# EAGLE design MGB-001-IO-NO-AUDIO (EAGLE 9.6.2)

## Sheet 1 of 2: GPIO
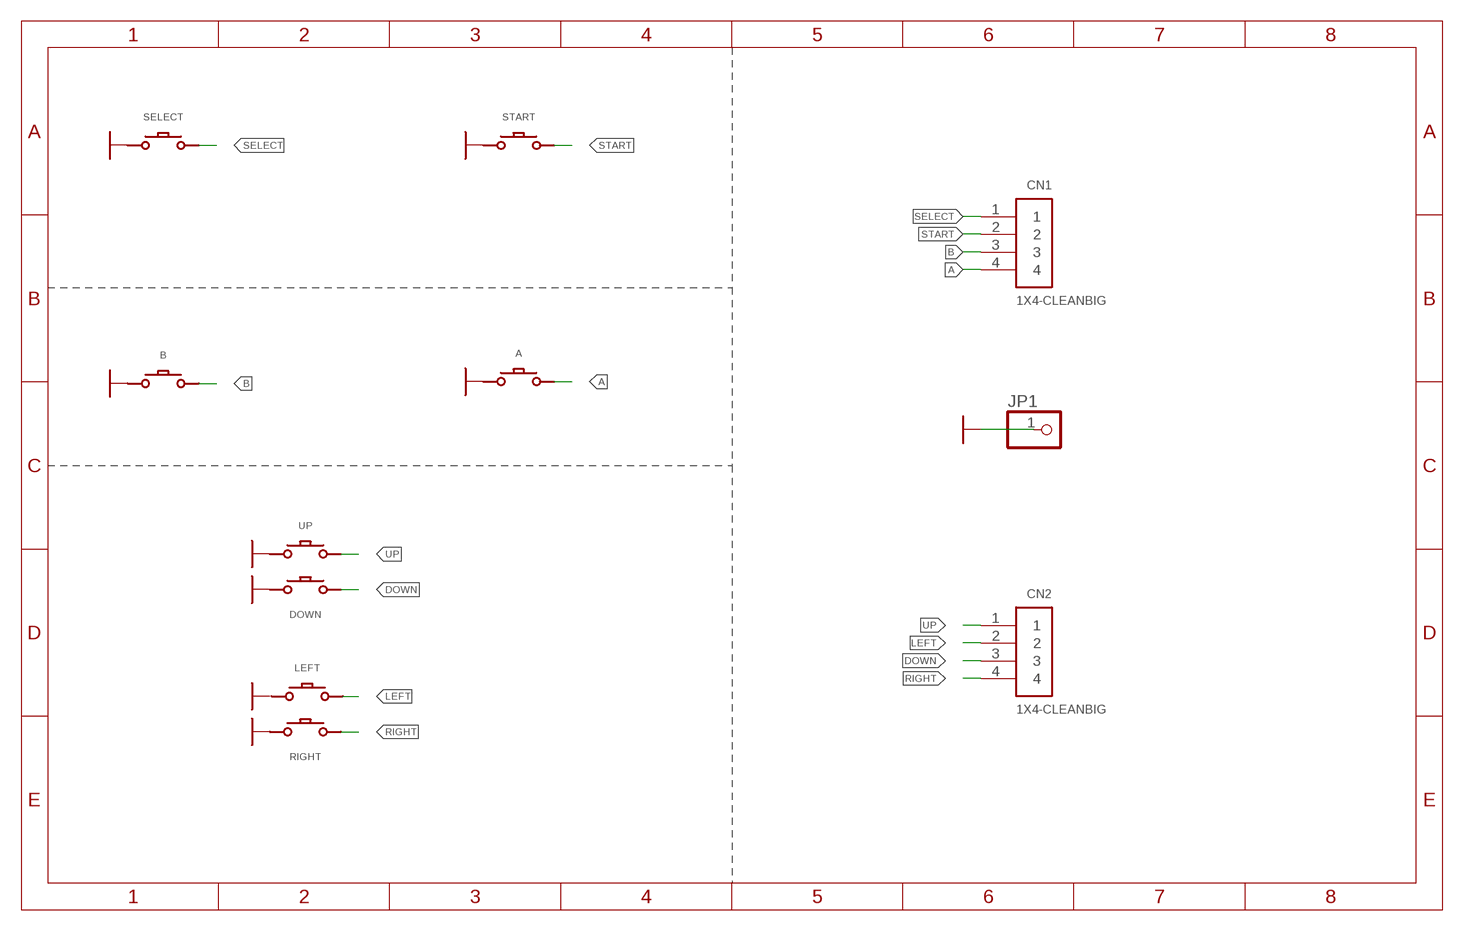
[diagram p0: schematic, sheet 1]

### Parts
A  CONDUCTIVE_BUTTONCONDUCTIVE_BUTTON_THICK  [CONDUCTIVE_BUTTON_THICK]
B  CONDUCTIVE_BUTTONCONDUCTIVE_BUTTON_THICK  [CONDUCTIVE_BUTTON_THICK]
CN1  1X4-CLEANBIG  [1X04-CLEANBIG]
CN2  1X4-CLEANBIG  [1X04-CLEANBIG]
DOWN  CONDUCTIVE_BUTTONCONDUCTIVE_BUTTON_DIRECTIONAL_THICK  [CONDUCTIVE_BUTTON_DIRECTIONAL_THICK]
JP1  PINHD-1X1CB  [1X01-CLEANBIG]
LEFT  CONDUCTIVE_BUTTONCONDUCTIVE_BUTTON_DIRECTIONAL_THICK  [CONDUCTIVE_BUTTON_DIRECTIONAL_THICK]
RIGHT  CONDUCTIVE_BUTTONCONDUCTIVE_BUTTON_DIRECTIONAL_THICK  [CONDUCTIVE_BUTTON_DIRECTIONAL_THICK]
SELECT  CONDUCTIVE_BUTTON_STARTSELECTCONDUCTIVE_BUTTON_THICK_STARTSELECT  [CONDUCTIVE_BUTTON_THICK_STARTSELECT]
START  CONDUCTIVE_BUTTON_STARTSELECTCONDUCTIVE_BUTTON_THICK_STARTSELECT  [CONDUCTIVE_BUTTON_THICK_STARTSELECT]
UP  CONDUCTIVE_BUTTONCONDUCTIVE_BUTTON_DIRECTIONAL_THICK  [CONDUCTIVE_BUTTON_DIRECTIONAL_THICK]

### Nets
A: A.P$ACTIVE CN1.4
B: B.P$ACTIVE CN1.3
DOWN: CN2.3 DOWN.P$ACTIVE
GND: A.P$GND B.P$GND DOWN.P$GND JP1.1 RIGHT.P$GND SELECT.P$GND SELECT.P$GND1(P$GND) SELECT.P$GND2(P$GND) SELECT.P$GND3(P$GND) START.P$GND START.P$GND1(P$GND) START.P$GND2(P$GND) START.P$GND3(P$GND) UP.P$GND
LEFT: CN2.2 LEFT.P$ACTIVE
RIGHT: CN2.4 RIGHT.P$ACTIVE
SELECT: CN1.1 SELECT.P$ACTIVE SELECT.P$ACTIVE1(P$ACTIVE) SELECT.P$ACTIVE2(P$ACTIVE) SELECT.P$ACTIVE3(P$ACTIVE) SELECT.P$ACTIVE4(P$ACTIVE) SELECT.P$ACTIVE5(P$ACTIVE) SELECT.P$ACTIVE6(P$ACTIVE)
START: CN1.2 START.P$ACTIVE START.P$ACTIVE1(P$ACTIVE) START.P$ACTIVE2(P$ACTIVE) START.P$ACTIVE3(P$ACTIVE) START.P$ACTIVE4(P$ACTIVE) START.P$ACTIVE5(P$ACTIVE) START.P$ACTIVE6(P$ACTIVE)
UP: CN2.1 UP.P$ACTIVE
Unconnected: LEFT.P$GND

## Sheet 2 of 2: Board and Logos
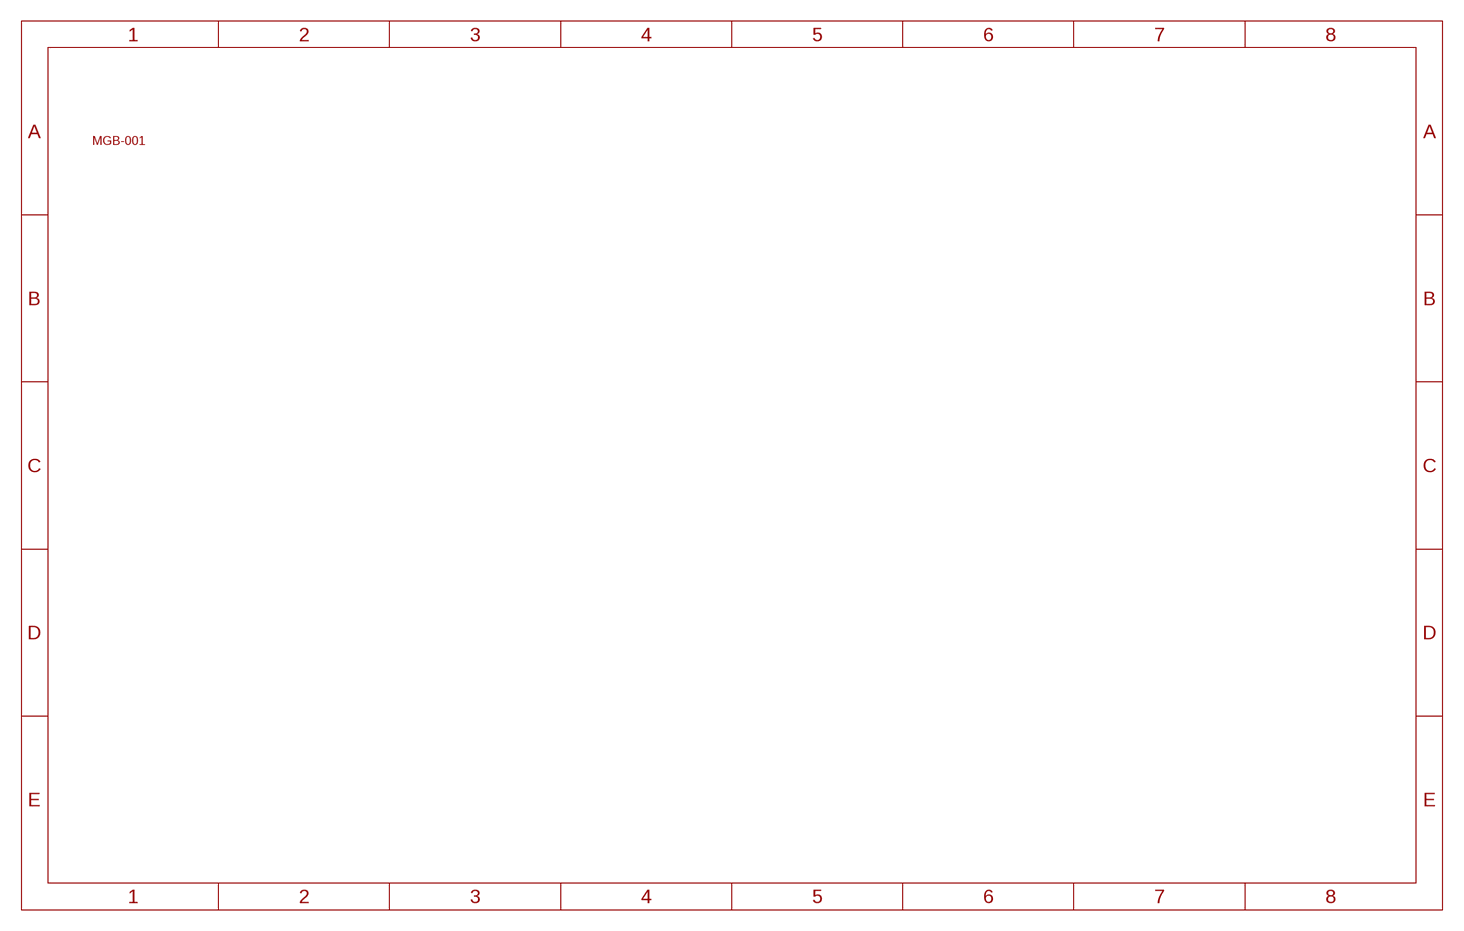
[diagram p1: schematic, sheet 2]

### Parts
U$17  MGB-001MGB-001-IO-NO-AUDIO  [MGB-001-IO-NO-AUDIO]

## Library data of the parts
A B DOWN LEFT RIGHT UP = RetroESP32:CONDUCTIVE_BUTTON; IGNORE_BOM: TRUE
CN1 CN2 = adafruit:1X4: 4-pin connector
JP1 = adafruit:PINHD-1X1: Pin header 1x1 for 0.1" spacing With round pins
SELECT START = RetroESP32:CONDUCTIVE_BUTTON_STARTSELECT; IGNORE_BOM: TRUE
U$17 = RetroESP32:MGB-001: MGB-001 Game Boy Pocket This is the footprint and dimensions outline for the Game Boy Pocket PCB Variants MGB-001 - Standard Game Boy Pocket MGB-001-ESP32 - Game Boy Pocket w/ Antenna Cut Out

## Board
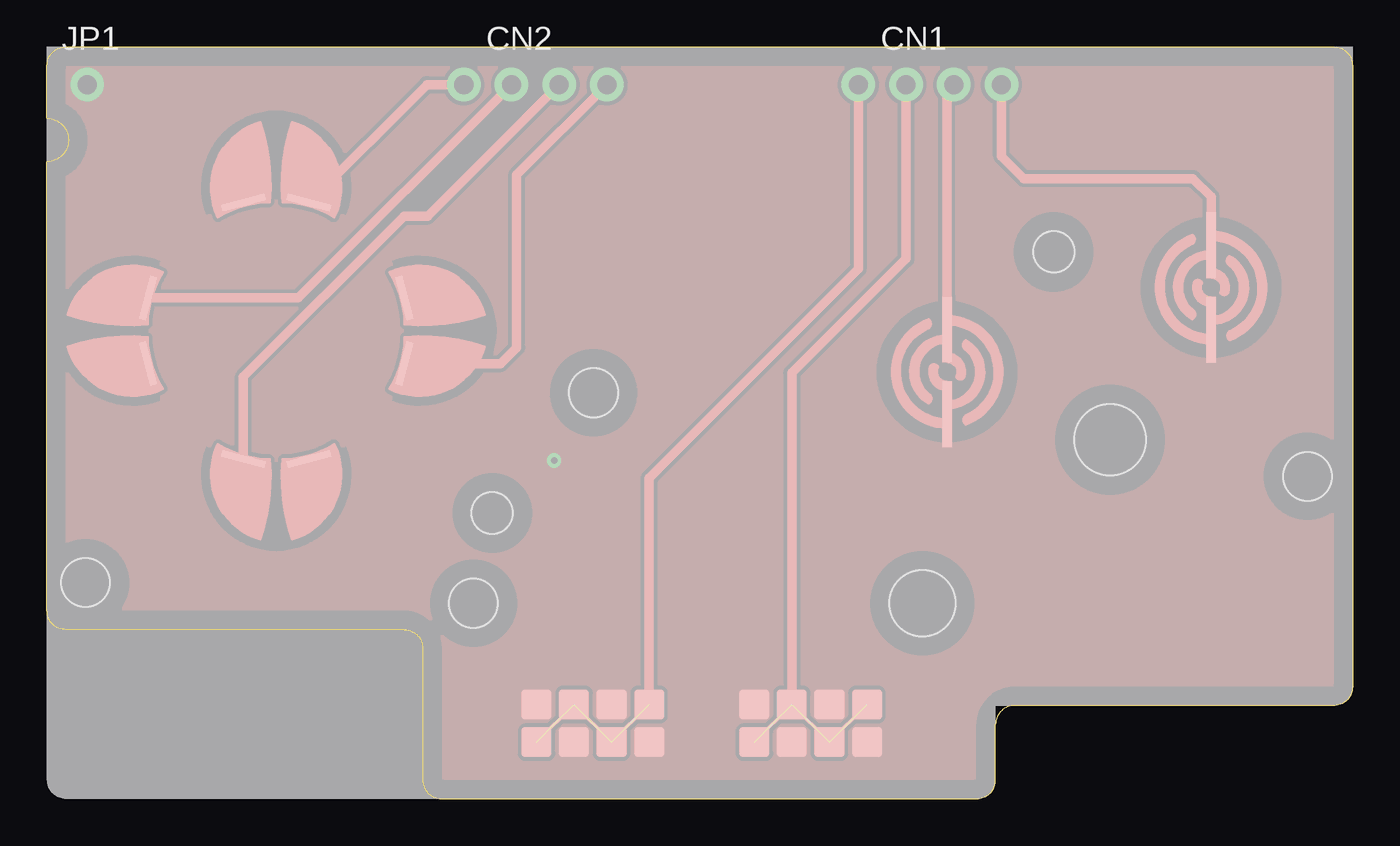
[diagram p2: board, top side]
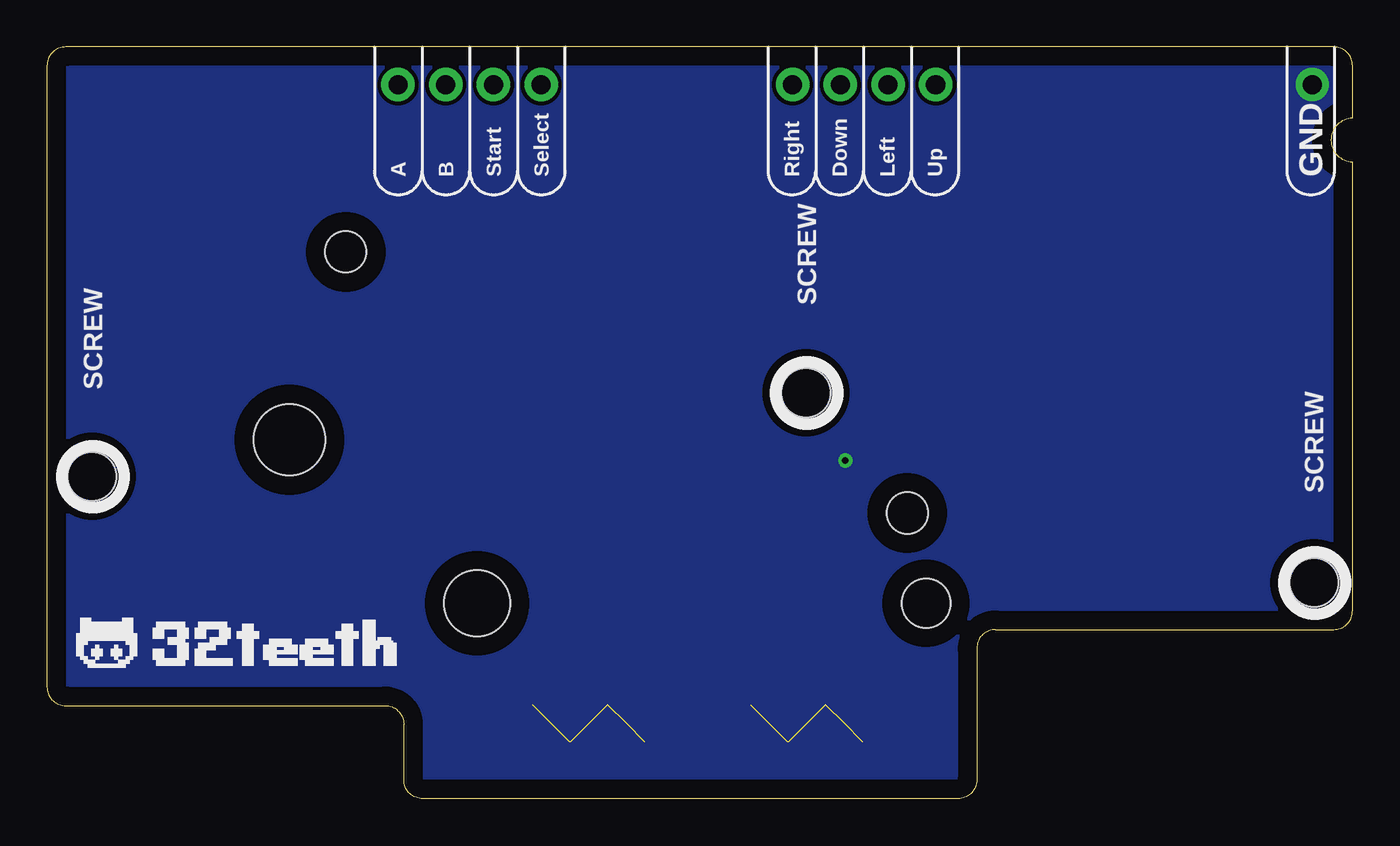
[diagram p3: board, bottom side, seen from below]

Size 69.5 x 40 mm. Coordinates in mm from the lower left corner, seen from the top.
Copper layers (1*16): Top 0.035mm / dielectric 1mm / Bottom 0.035mm
Design rules "default *": minimum track width 10mil, minimum drill 24mil, track to track 8mil, track to pad 8mil, pad to pad 8mil, via to via 8mil, smd to smd 8mil, copper to edge 40mil, drill to drill 8mil, minimum pad ring 10mil, minimum via ring 8mil, stop-mask expansion 5mil, vias tented up to drill 10mil, thermal gap 10mil

### Footprints (pad centres in the part's own frame; a part is rotated, then mirrored left to right if it is on the bottom)
CONDUCTIVE_BUTTON_THICK = smd 0.5 x 3.5: P$ACTIVE 0,-2.25; P$GND 0,2.25
1X04-CLEANBIG = drill 1.016 pad 1.778: 1 -3.81,0; 2 -1.27,0; 3 1.27,0; 4 3.81,0
CONDUCTIVE_BUTTON_DIRECTIONAL_THICK = smd 2.4 x 0.4 rotated 75: P$ACTIVE 0.875,1.75 | smd 2.4 x 0.4 rotated 285: P$GND 0.875,-1.75
1X01-CLEANBIG = drill 1.016 pad 1.778: 1 0,0
CONDUCTIVE_BUTTON_THICK_STARTSELECT = smd 1.6 x 1.6: P$ACTIVE 3,1; P$ACTIVE1 -1,1; P$ACTIVE2 -3,-1; P$ACTIVE3 1,-1; P$GND 1,1; P$GND1 -3,1; P$GND2 -1,-1; P$GND3 3,-1 | smd 2.54 x 0.185 rotated 45: P$ACTIVE4 -2,0 | smd 2.54 x 0.185 rotated 135: P$ACTIVE5 0,0 | smd 2.54 x 0.185 rotated 225: P$ACTIVE6 2,0
MGB-001-IO-NO-AUDIO = hole 2.6: 67.1,17.15; 29.1,21.6; 22.7,10.4; 2.05,11.5 | hole 3.8: 56.6,19.1 | hole 2.2: 53.6,29.1; 23.7,15.2 | hole 3.5: 46.6,10.4

### Placement (x,y rotation side)
A  61.97,27.2 180 top
B  47.92,22.71 180 top
CN1  47,38 0 top
CN2  26,38 0 top
DOWN  12.2,17.2 90 top
JP1  2.14,38 0 top
LEFT  4.5,24.9 0 top
RIGHT  19.9,24.9 180 top
SELECT  29.05,4.01 0 top
START  40.66,4.01 0 top
U$17  0,0 0 top
UP  12.2,32.6 270 top

### Tracks (layer width: path | path; a pad name or v marks a point on that pad's centre or on a via)
A
  Top 0.508: A.P$ACTIVE 61.97,32.03 61,33 52,33 50.81,34.19 CN1.4
B
  Top 0.508: B.P$ACTIVE 47.92,37.65 CN1.3
DOWN
  Top 0.508: DOWN.P$ACTIVE 10.45,22.45 19,31 20.27,31 CN2.3
GND  (via drill 0.35)
  other vias: 27,18
  pour Bottom (rank 6, no thermals): 0,0 50.5,0 50.5,4.95 69.5,4.95 69.5,40 0,40
  pour Top (rank 2, no thermals): 0,0 50.5,0 50.5,4.95 69.5,4.95 69.5,40 0,40
LEFT
  Top 0.508: LEFT.P$ACTIVE 13.38,26.65 CN2.2
RIGHT
  Top 0.508: RIGHT.P$ACTIVE 24.15,23.15 25,24 25,33.19 CN2.4
SELECT  (6 unrouted)
  Top 0.508: CN1.1 43.19,28.19 32.05,17.05 SELECT.P$ACTIVE
START  (6 unrouted)
  Top 0.508: CN1.2 45.73,28.73 39.66,22.66 START.P$ACTIVE1
UP
  Top 0.508: UP.P$ACTIVE 20.23,38 CN2.1

### Text on the board
bPlace: GND | Up | Left | Down | Right | Select | Start | B | A